# Altium schematic sheet GTM_ProgrammingConnector.SchDoc
size A4
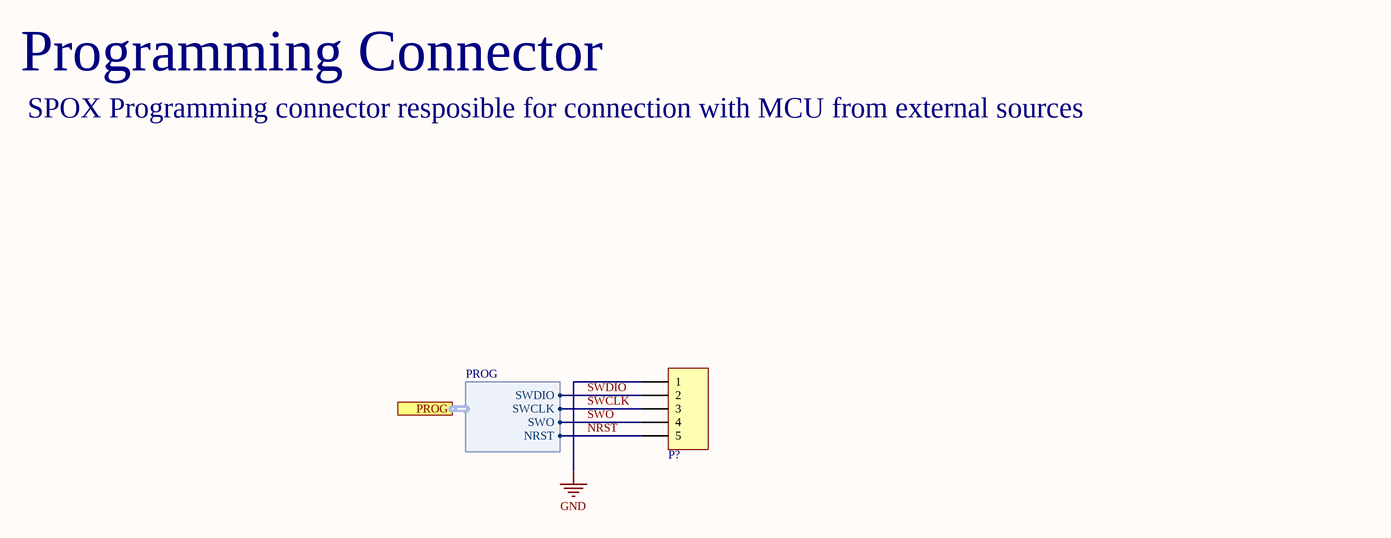
[diagram p0: GTM_ProgrammingConnector.SchDoc]

## Parts
P?  HDR1X5  [Molex SPOX Angle 5 Circuits]  (value not drawn)

## Ports
PROG (harness PROG)

## Harnesses
PROG: SWDIO, SWCLK, SWO, NRST

## Nets
GND: P?.1
NRST: P?.5 ; port PROG.NRST
SWCLK: P?.3 ; port PROG.SWCLK
SWDIO: P?.2 ; port PROG.SWDIO
SWO: P?.4 ; port PROG.SWO

## Notes on the sheet
- Programming Connector
- SPOX Programming connector resposible for connection with MCU from external sources
- Project
- Rev.
- Title
- Drawn by
- Date
- Sheet
- of
- Checked by

## Library data of the parts
P? = HDR1X5: Header, 5-Pin; LatestRevisionDate: 17-Jul-2002; LatestRevisionNote: Re-released for DXP Platform.; Publisher: Altium Limited